# EAGLE design golden (EAGLE 9.6.2)
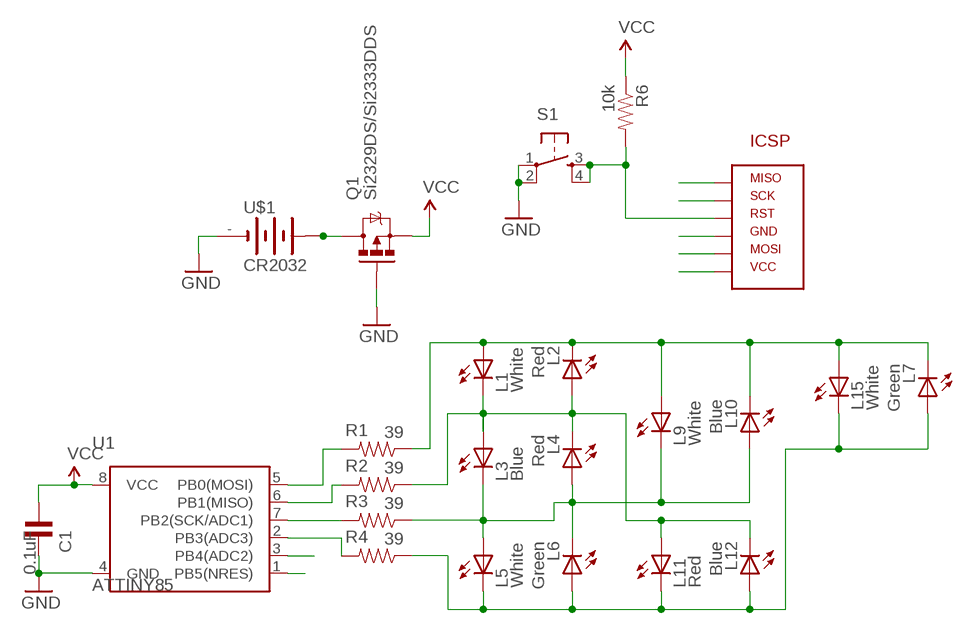
[diagram p0: schematic, sheet 1]

## Parts
C1  0.1uF  CAPACITOR0805  [C0805]
L1  White  LED0805  [LED-0805]
L2  Red  LED0805  [LED-0805]
L3  Blue  LED0805  [LED-0805]
L4  Red  LED0805  [LED-0805]
L5  White  LED0805  [LED-0805]
L6  Green  LED0805  [LED-0805]
L7  Green  LED0805  [LED-0805]
L9  White  LED0805  [LED-0805]
L10  Blue  LED0805  [LED-0805]
L11  Red  LED0805  [LED-0805]
L12  Blue  LED0805  [LED-0805]
L15  White  LED0805  [LED-0805]
Q1  Si2329DS/Si2333DDS  MOSFET_P_CH  [SOT23-3A]
R1  39  RESISTORR0805-SMD  [R0805]
R2  39  RESISTORR0805-SMD  [R0805]
R3  39  RESISTORR0805-SMD  [R0805]
R4  39  RESISTORR0805-SMD  [R0805]
R6  10k  RESISTORR0805-SMD  [R0805]
S1  TAC_SWITCHSMD  [TACTILE_SWITCH_SMD]
U1  ATTINY85  [SOIC-8]
U$1  CR2032  BAT-HLD-001  [BAT-HLD-001]
U$2  AVR_ICSP_6P1X6  [AVR_ICSP_1X6_SMD]

## Nets
GND: C1.2 Q1.1(G) S1.1 S1.2 U1.4(GND) U$1.- U$2.P6(GND)
L12: L1.C L2.A L3.A L4.C L11.A L12.C R2.1
MISO: R2.2 U1.6(PB1(MISO)) U$2.P5(MISO)
MOSI: R1.2 U1.5(PB0(MOSI)) U$2.P4(MOSI)
N$1: Q1.3(D) U$1.+@1(+) U$1.+@2(+)
N$2: U1.3(PB4(ADC2))
N$3: L3.C L4.A L5.A L6.C L9.C L10.A R3.1
N$4: R4.2 U1.2(PB3(ADC3))
N$6: L1.A L2.C L7.C L9.A L10.C L15.A R1.1
N$10: L5.C L6.A L7.A L11.C L12.A L15.C R4.1
RST: R6.2 S1.3 S1.4 U1.1(PB5(NRES)) U$2.P3(RST)
SCK: R3.2 U1.7(PB2(SCK/ADC1)) U$2.P2(SCK)
VCC: C1.1 Q1.2(S) R6.1 U1.8(VCC) U$2.P1(VCC)

## Notes on the sheet
- ICSP

## Library data of the parts
C1 = My Custom Parts:CAPACITOR
L1-L7 L9-L12 L15 = My Custom Parts:LED
Q1 = My Custom Parts:MOSFET_P_CH
R1-R4 R6 = My Custom Parts:RESISTOR: SMD chip resistors
S1 = My Custom Parts:TAC_SWITCH: Momentary Switch Button commonly used for reset or general input. Spark Fun Electronics SKU : COM-00097 SMT- SWCH-08247; PROD_ID: SWCH-08247
U1 = My Custom Parts:ATTINY85; PROD_ID: IC-09092
U$1 = My Custom Parts:BAT-HLD-001
U$2 = AVR_ICSP_Footprints:AVR_ICSP_6P

## Board
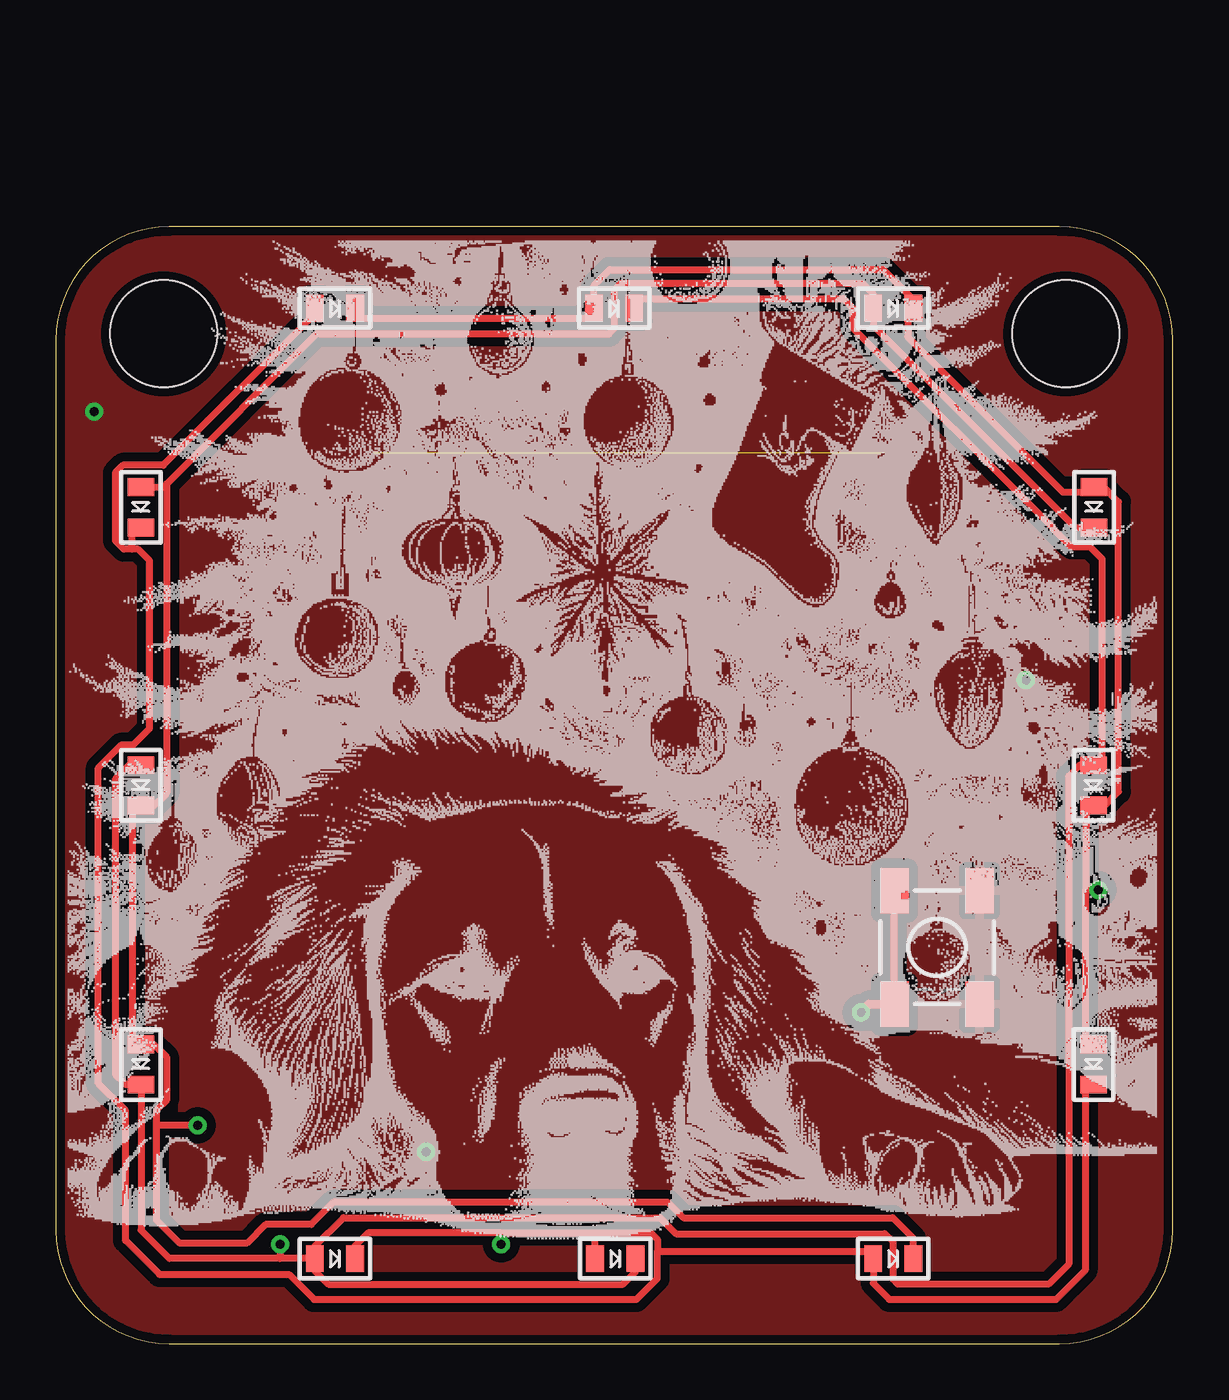
[diagram p1: board, top side]
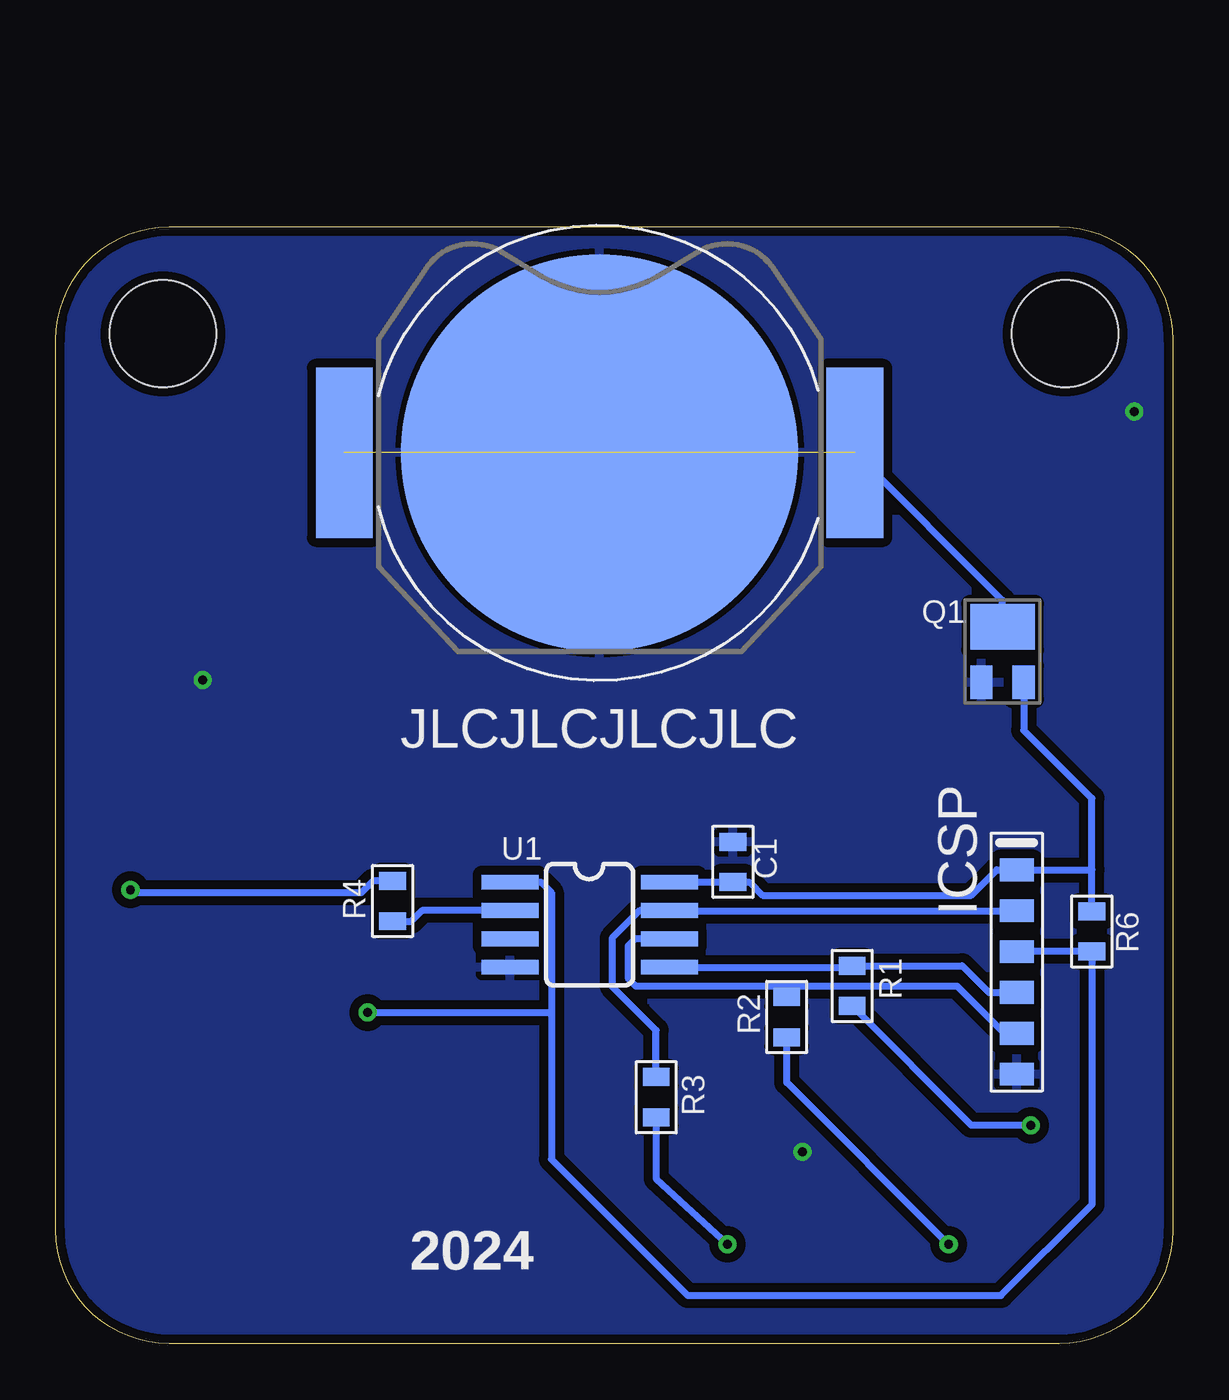
[diagram p2: board, bottom side, seen from below]

Size 50 x 50 mm. Coordinates in mm from the lower left corner, seen from the top.
Outline: 0,44.92 0,5.08 arc90 5.08,0 44.92,0 arc90 50,5.08 50,44.92 arc90 44.92,50 5.08,50 arc90 0,44.92
Copper layers (1*16): Top 0.035mm / dielectric 1.5mm / Bottom 0.035mm
Design rules "Tim-JLC": minimum track width 8mil, minimum drill 15mil, track to track 8mil, track to pad 8mil, pad to pad 8mil, via to via 8mil, smd to smd 0mil, copper to edge 10mil, drill to drill 10mil, minimum pad ring 10mil, minimum via ring 8mil, stop-mask expansion 2mil, vias tented up to drill 100mil, thermal gap 10mil
Holes 4.76 mm at 4.83,45.21 45.21,45.21

### Footprints (pad centres in the part's own frame; a part is rotated, then mirrored left to right if it is on the bottom)
C0805 = smd 0.8 x 1.2: 1 -0.9,0; 2 0.9,0
LED-0805 = smd 0.8 x 1.2: A -0.9,0; C 0.9,0
SOT23-3A = smd 1 x 1.5: 1 -0.95,-1.254; 2 0.95,-1.254 | smd 2.9 x 2.05: 3 0,1.227
R0805 = smd 0.8 x 1.2: 1 -0.9,0; 2 0.9,0
TACTILE_SWITCH_SMD = smd 2.032 x 1.27: 1 -2.54,1.905; 2 2.54,1.905; 3 -2.54,-1.905; 4 2.54,-1.905
SOIC-8 = smd 0.66 x 2.54: 1 -1.905,-3.569; 2 -0.635,-3.569; 3 0.635,-3.569; 4 1.905,-3.569; 5 1.905,3.569; 6 0.635,3.569; 7 -0.635,3.569; 8 -1.905,3.569
BAT-HLD-001 = smd 2.54 x 7.62: +@1 -11.43,0; +@2 11.43,0 | smd 17.78 x 17.78: - 0,0
AVR_ICSP_1X6_SMD = smd 1.016 x 1.524: P1 9.144,0; P2 7.315,0; P3 5.486,0; P4 3.658,0; P5 1.829,0; P6 0,0

### Placement (x,y rotation side)
C1  19.68,21.56 90 bottom
L1  3.81,12.5 270 top
L2  3.81,24.99 270 top
L3  12.5,3.81 0 top
L4  25.05,3.81 0 top
L5  12.5,46.35 0 top
L6  46.46,12.5 270 top
L7  46.48,37.44 270 top
L9  3.81,37.44 270 top
L10  37.49,3.81 0 top
L11  46.46,24.99 270 top
L12  24.99,46.35 0 top
L15  37.49,46.35 0 top
Q1  7.62,30.86 0 bottom
R1  14.35,16.01 90 bottom
R2  17.28,14.62 90 bottom
R3  23.12,11.04 90 bottom
R4  34.92,19.81 270 bottom
R6  3.62,18.45 270 bottom
S1  39.45,17.74 270 top
U1  26.1,18.76 270 bottom
U$1  25.65,39.88 180 bottom
U$2  6.99,12.06 90 bottom

### Tracks (layer width: path | path; a pad name or v marks a point on that pad's centre or on a via)
GND  (via drill 0.4)
  other vias: 43.43,29.72 1.71,41.73 16.57,8.58
  pour Top (isolate 0.406): -1.14,50.93 -1.14,-1.14 52.32,-1.14 52.32,50.93
  pour Bottom (isolate 0.406): -0.64,51.69 50.8,51.56 50.55,-1.14 -0.89,-1.02
  pour Top (isolate 0.406, no thermals): 13.34,4.57 24.13,4.57 24.13,2.79 13.34,2.79
  pour Bottom (isolate 0.406): 2.54,22.61 25.91,22.61 25.91,15.37 2.54,15.37
L12  (via drill 0.4)
  Top 0.305: L12.C 25.89,46.79 35.26,46.79 35.69,46.35 35.69,45.47 44.65,36.5 44.65,36.47 45.47,35.66 46.3,35.66 46.84,35.13 46.84,25.89 L11.A 45.83,25.89 45.34,25.4 45.34,3.56 44.45,2.67 37.69,2.67 37.47,2.9 37.47,4.57 37.11,4.93 27.76,4.93 27.05,5.64 12.88,5.64 11.6,4.36 L3.A | L3.A 10.03,3.81 | 10.03,3.81 5.08,3.81 3.81,5.08 L1.C 3.13,11.6 2.67,12.06 2.67,25.27 3.29,25.89 L2.A | L3.A 11.6,3.26 12.19,2.67 25.4,2.67 25.95,3.21 L4.C | v10.03,4.45 10.03,3.81
  Bottom 0.305: R2.1 17.28,11.69 v10.03,4.45
MISO
  Bottom 0.305: U1.6 24.07,18.12 24.38,17.8 24.38,16.36 24.03,16 17.27,16 | 17.27,16 17.28,15.99 R2.2 | U$2.P5 7.54,13.89 9.65,16 17.27,16
MOSI
  Bottom 0.305: U$2.P4 8.23,15.72 9.42,16.91 R1.2 14.41,16.85 U1.5
N$1  (1 unrouted)
  Bottom 0.305: Q1.3 7.62,33.27 U$1.+@1
N$3  (via drill 0.4)
  Top 0.305: L6.C 46.08,11.22 46.08,3.28 44.78,1.98 37.31,1.98 36.59,2.7 L10.A 36.29,4.12 26.92,4.12 | L5.A 11.6,46.1 4.82,39.32 3,39.32 2.67,38.99 2.67,35.94 3.05,35.56 3.4,35.56 | 26.92,4.12 26.92,2.92 25.98,1.98 11.56,1.98 10.44,3.1 4.65,3.1 3.12,4.62 3.12,10.44 1.91,11.66 1.91,25.78 2.92,26.8 3.45,26.8 4.19,27.53 4.19,35.05 3.68,35.56 3.4,35.56 | 26.92,4.12 26.92,4.67 26.64,4.95 24.16,4.95 | L9.C 3.4,36.54 3.4,35.56 | 19.94,4.95 13.97,4.95 13.4,4.38 L3.C | v19.94,4.45 19.94,4.95 | 19.94,4.95 24.16,4.95 | L4.A 24.14,4.94 24.16,4.95
  Bottom 0.305: R3.1 23.12,7.38 v19.94,4.45
N$4
  Bottom 0.305: U1.2 33.61,19.39 34.09,18.91 R4.2
N$6  (via drill 0.4)
  Top 0.305: 4.95,38.35 4.95,38.48 11.68,45.21 24.77,45.21 24.99,45.44 24.99,47.17 25.27,47.45 36.12,47.45 36.59,46.98 L15.A 36.59,45.58 45.63,36.54 L7.C | 4.95,38.35 4.95,24.64 4.41,24.09 L2.C 3.43,23.71 3.43,13.78 L1.A 4.38,13.4 4.95,12.83 4.95,10.9 4.5,10.44 4.5,9.78 | L10.C 38.39,4.71 37.47,5.64 28.09,5.64 27.41,6.33 12.42,6.33 11.43,5.33 9.4,5.33 8.59,4.52 5.51,4.52 4.5,5.54 4.5,9.78 | L9.A 3.83,38.35 4.95,38.35 | v6.35,9.78 4.5,9.78
  Bottom 0.305: v6.35,9.78 9.02,9.78 R1.1
N$10  (via drill 0.4)
  Top 0.305: L6.A 46.1,13.4 46.1,20.32 | 46.1,20.32 46.1,23.74 L11.C 46.95,24.09 47.57,24.71 47.57,37.68 46.91,38.34 L7.A 46.25,38.11 45.09,38.11 38.14,45.06 38.14,46.1 L15.C 38.39,46.74 37.04,48.08 24.79,48.08 24.09,47.38 L12.A 24.09,45.9 13.4,45.9 L5.C | v46.66,20.32 46.1,20.32
  Bottom 0.305: v46.66,20.32 46.53,20.19 36.32,20.19 35.8,20.71 R4.1
RST  (via drill 0.4)
  Top 0.305: S1.4 S1.3
  Top 0.406: v36.05,14.82 v36.05,14.83 36.42,15.2 S1.4
  Bottom 0.305: U1.1 28.28,20.66 27.81,20.19 27.81,14.82 | U$2.P3 R6.2 3.62,6.22 7.68,2.16 21.72,2.16 27.81,8.26 27.81,14.82 | v36.05,14.82 27.81,14.82
SCK
  Bottom 0.305: U$2.P2 22.73,19.38 U1.7 23.86,19.39 25.09,18.16 25.09,16 23.12,14.03 R3.2
VCC
  Bottom 0.305: Q1.2 6.67,27.46 3.62,24.41 3.62,21.21 | R6.1 3.62,21.21 | 3.62,21.21 U$2.P1 7.87,21.21 9.02,20.07 18.36,20.07 18.96,20.66 C1.1 22.75,20.66 U1.8

### Text on the board
bPlace: JLCJLCJLCJLC | 2024
bNames: ICSP